# Altium schematic sheet 2312_Puissance.SchDoc
size A3; Author: Miguel Santos; Organization: ETML-ES; Address1: Avenue Recordon 1; Address2: 1004 Lausanne; Address3: Switzerland; SheetNumber: 2; SheetTotal: 7; Version: 1.0
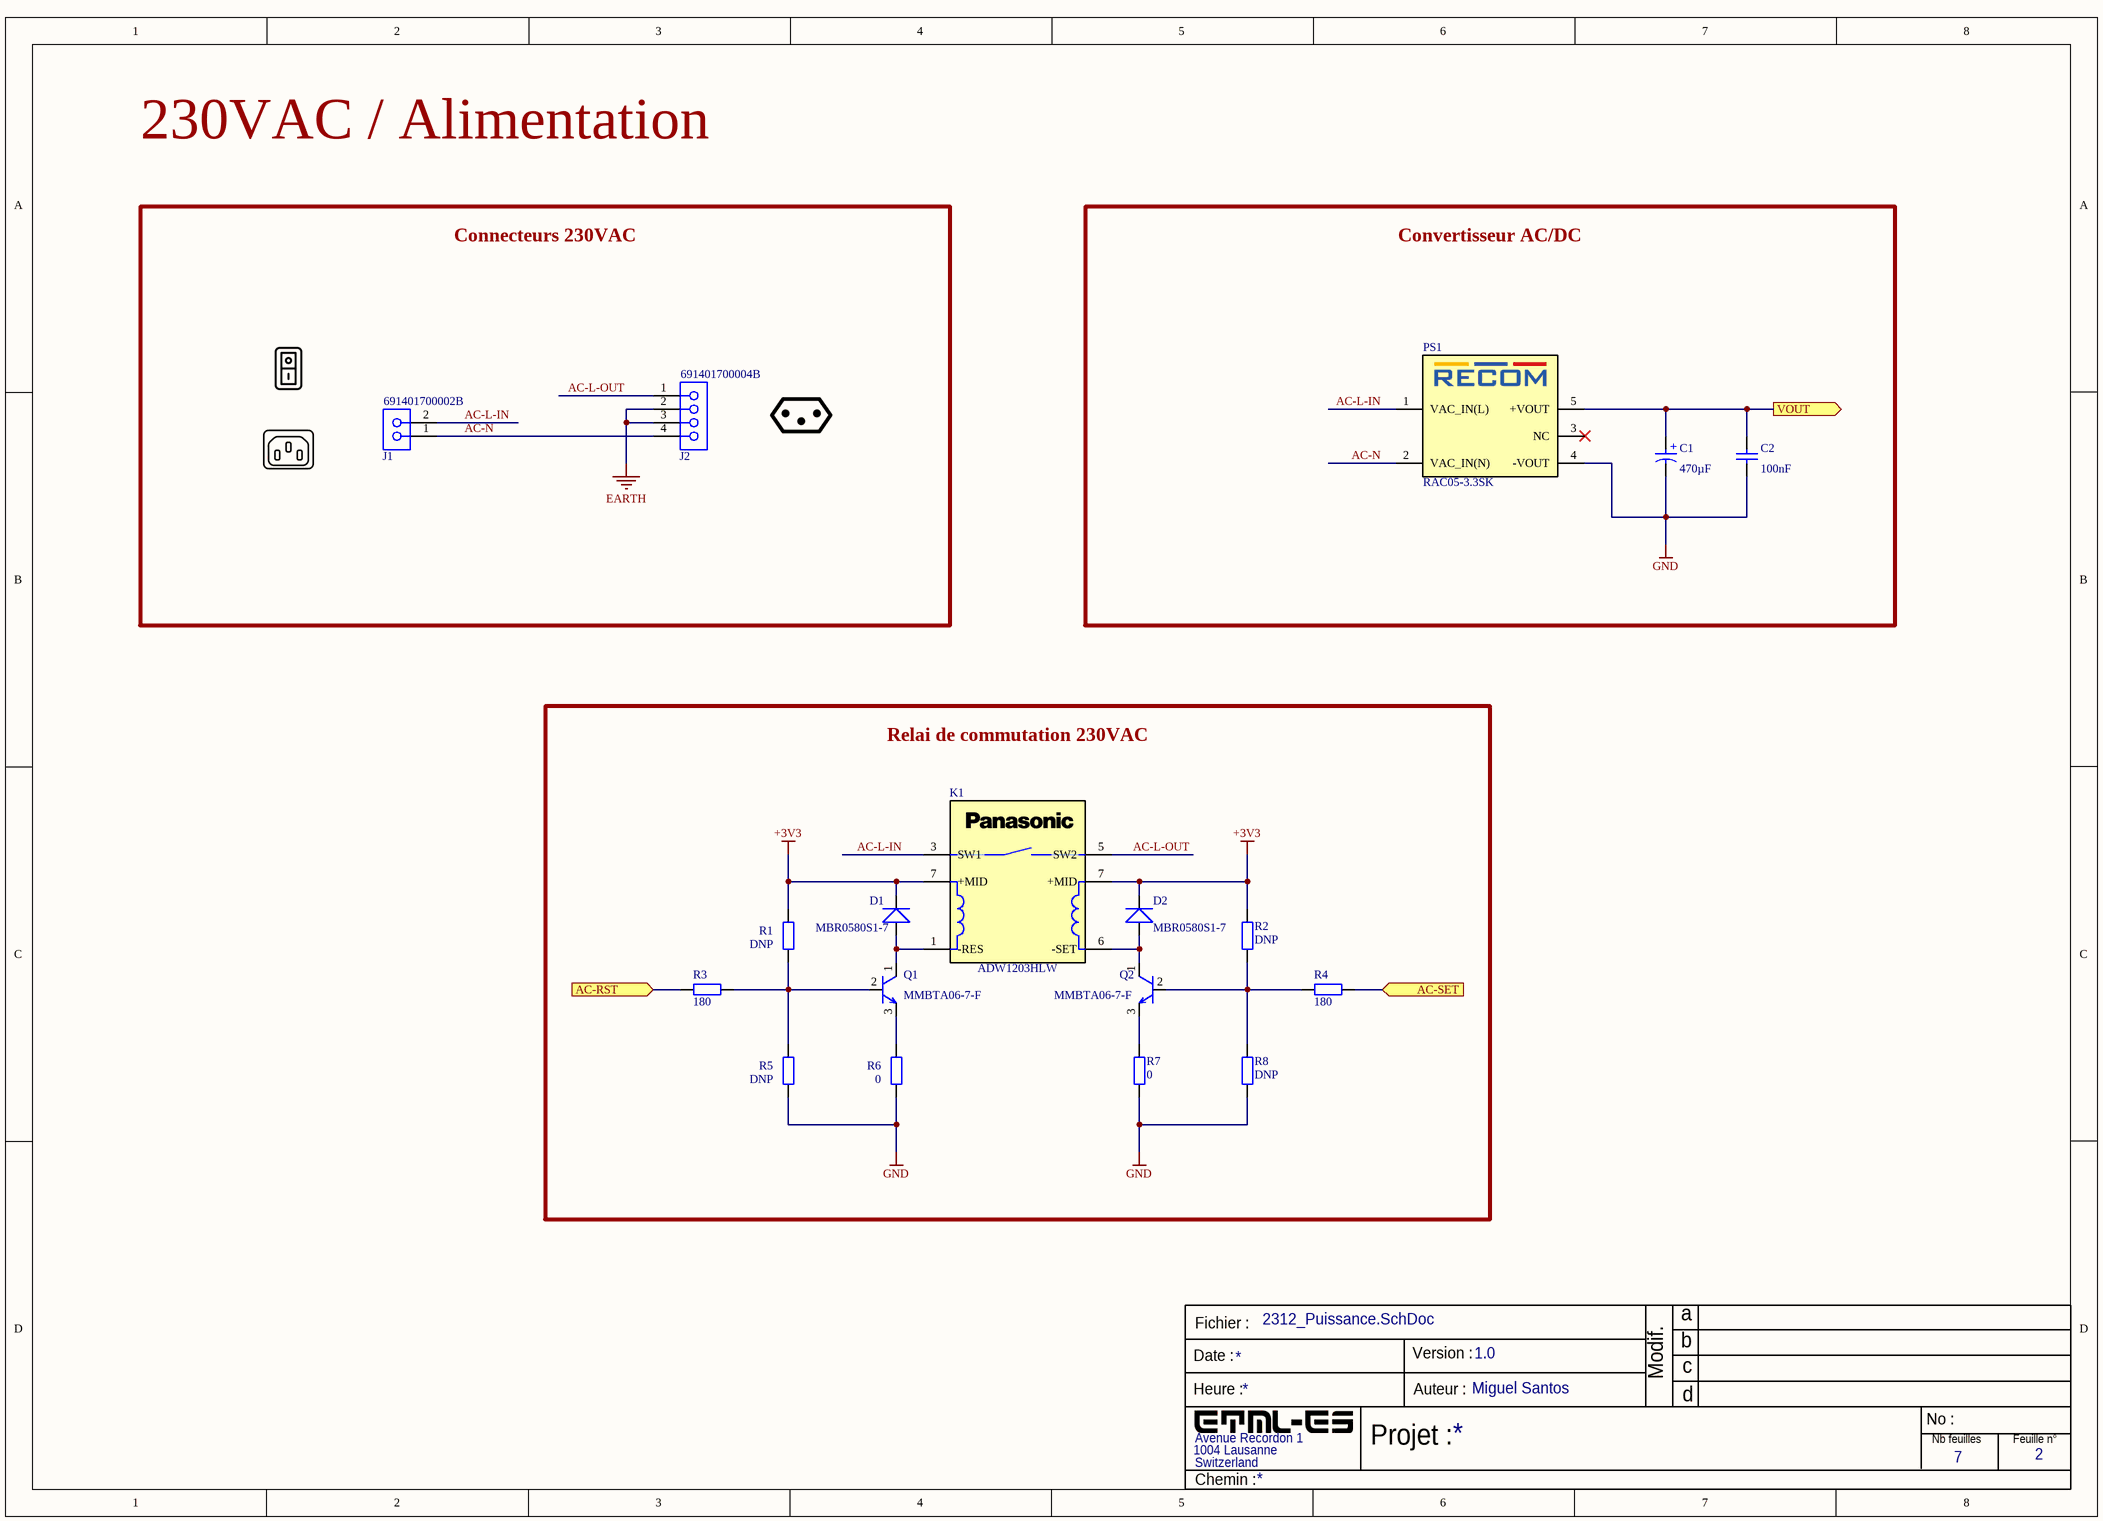
[diagram p0: 2312_Puissance.SchDoc]

## Parts
C1  Capacitance: 470µF  [WCAP-PSHP_D8H7.7]  (hidden comment: 875115150005)
C2  Capacitance: 100nF  [WCAP-CSGP_0805_L2W1.25H0.8_Reflow]  (hidden comment: 885012207016)
D1  MBR0580S1-7  [MBR0580S1-7_DIO-M]
D2  MBR0580S1-7  [MBR0580S1-7_DIO-M]
J1  691401700002B  [691401700002B]
J2  691401700004B  [691401700004B]
K1  ADW1203HLW  [ADW1203HLW]
PS1  RAC05-3.3SK  [CONV_RAC05-3.3SK]
Q1  MMBTA06-7-F  [SOT91P240X120-3N]
Q2  MMBTA06-7-F  [SOT91P240X120-3N]
R1  Resistance: DNP  [2312-RES-0805]  (hidden comment: RES-0805)
R2  Resistance: DNP  [2312-RES-0805]  (hidden comment: RES-0805)
R3  Resistance: 180  [2312-RES-0805]  (hidden comment: RES-0805)
R4  Resistance: 180  [2312-RES-0805]  (hidden comment: RES-0805)
R5  Resistance: DNP  [2312-RES-0805]  (hidden comment: RES-0805)
R6  Resistance: 0  [2312-RES-0805]  (hidden comment: RES-0805)
R7  Resistance: 0  [2312-RES-0805]  (hidden comment: RES-0805)
R8  Resistance: DNP  [2312-RES-0805]  (hidden comment: RES-0805)

## Blocks framed on the sheet
Connecteurs 230VAC: J1 J2
Convertisseur AC/DC: C1 C2 PS1
Relai de commutation 230VAC: D1 D2 K1 Q1 Q2 R1-R8

## Ports
AC-RST (in), AC-SET (in), VOUT (out)

## Nets
+3V3: D1.2 D2.2 K1.7(+MID) R1.2 R2.2
EARTH: J2.2 J2.3
GND: C1.2(N) C2.1 PS1.4(-VOUT) R5.1 R6.1 R7.1 R8.1
AC-L-IN: J1.2 K1.3(SW1) PS1.1(VAC_IN(L))
AC-L-OUT: J2.1 K1.5(SW2)
AC-N: J1.1 J2.4 PS1.2(VAC_IN(N))
AC-RST: R3.2 ; port AC-RST
AC-SET: R4.1 ; port AC-SET
VOUT: C1.1(P) C2.2 PS1.5(+VOUT) ; port VOUT
NetD1_1: D1.1 K1.1(-RES) Q1.1(COLLECTOR)
NetD2_1: D2.1 K1.6(-SET) Q2.1(COLLECTOR)
NetQ1_2: Q1.2(BASE) R1.1 R3.1 R5.2
NetQ1_3: Q1.3(EMITTER) R6.2
NetQ2_2: Q2.2(BASE) R2.1 R4.2 R8.2
NetQ2_3: Q2.3(EMITTER) R7.2

Not connected (* = marked no-connect by the designer): PS1 3(NC)*

## Notes on the sheet
- 230VAC / Alimentation
- Fichier :
- a
- Date :
- Heure :
- Version :
- Auteur :
- Modif.
- b
- c
- d
- Projet :
- No :
- Nb feuilles
- Feuille n°
- Chemin :
- (in symbol 875115150005) +

## Library data of the parts
C1 = 875115150005: WCAP-PSHP Aluminum Polymer Capacitor, V-Chip, SMT, D8 x H7.7mm, 470µF, 6.3V; Manufacturer: Wurth Elektronik; Capacitance Tolerance: +/-20%; Dissipation Factor: 8%; Endurance: 2000h; ESR: 20mΩ; Leakage Current: 592µA; Ripple Current: 3500mA; Technical Reference: PSEE077471M6R3DVCTDB000; Manufacturer Part Number: 875115150005; Category: Aluminum Polymer Capacitors; Match Code: WCAP-PSHP; ComponentLink1Description: Website Link; ComponentLink1URL: https://www.we-online.com/redexpert/article/875115150005?ad; ComponentLink2Description: Datasheet Link; ComponentLink2URL: https://www.we-online.com/redexpert/spec/875115150005?ad; Mount: Surface Mount; Operating Temperature Max: 105°C; Operating Temperature Min: -55°C; Packaging: Tape and Reel; Height: 7.7mm; Diameter: 8mm; Rated Voltage (DC): 6.3V
C2 = 885012207016: WCAP-CSGP Multilayer Ceramic Chip Capacitor, General Purpose, size 0805, X7R, 100nF, 10VDC; Manufacturer: Wurth Elektronik; Case/Size Code: 0805; Capacitance Tolerance: +/-10%; Dissipation Factor: 5%; Insulation Resistance: 5GΩ; Rated Voltage (DC): 10V; Technical Reference: X7R0805104K010DFCT10000; Manufacturer Part Number: 885012207016; Category: Multilayer Ceramic Chip Capacitors; Match Code: WCAP-CSGP; ComponentLink1Description: Website Link; ComponentLink1URL: https://www.we-online.com/redexpert/article/885012207016?ad; ComponentLink2Description: Datasheet Link; ComponentLink2URL: https://www.we-online.com/redexpert/spec/885012207016?ad; Mount: Surface Mount; Operating Temperature Max: 125°C; Operating Temperature Min: -55°C; Packaging: Tape and Reel; Length: 2mm; Width: 1.25mm; Height: 0.8mm; Ceramic Type: X7R
D1 D2 = MBR0580S1-7: Diode Shottky, 500mA, 80V; Mfr_Name: Diodes Inc; Digi-Key_Part_Number_3: MBR0580S1-7DIDKR-ND; Digi-Key_Part_Number_2: MBR0580S1-7DICT-ND; Digi-Key_Part_Number_1: MBR0580S1-7DITR-ND; RefDes: RefDes; Type: Type
J1 = 691401700002B: WR-TBL Series 401B Vertical Entry, THT, pitch 5mm, 2p; Manufacturer: Wurth Elektronik; Modularity: No; Rated Current: 10A; Working Voltage: 300V; ComponentLink1Description: Website Link; ComponentLink1URL: https://www.we-online.com/redexpert/article/691401700002B?ad; ComponentLink2Description: Datasheet Link; ComponentLink2URL: https://www.we-online.com/redexpert/spec/691401700002B?ad; Manufacturer Part Number: 691401700002B; Category: Terminal Blocks; Match Code: WR-TBL; Mount: Through Hole; Operating Temperature Max: 105°C; Operating Temperature Min: -40°C; Packaging: Box; Application: Screwless; Number of Pins: 2; Number of Rows: 1; Orientation: Vertical; Pitch: 5mm
J2 = 691401700004B: WR-TBL Series 401B Vertical Entry, THT, pitch 5mm, 4p; Manufacturer: Wurth Elektronik; Modularity: No; Rated Current: 10A; Working Voltage: 300V; ComponentLink1Description: Website Link; ComponentLink1URL: https://www.we-online.com/redexpert/article/691401700004B?ad; ComponentLink2Description: Datasheet Link; ComponentLink2URL: https://www.we-online.com/redexpert/spec/691401700004B?ad; Manufacturer Part Number: 691401700004B; Category: Terminal Blocks; Match Code: WR-TBL; Mount: Through Hole; Operating Temperature Max: 105°C; Operating Temperature Min: -40°C; Packaging: Box; Application: Screwless; Number of Pins: 4; Number of Rows: 1; Orientation: Vertical; Pitch: 5mm
K1 = ADW1203HLW: RELAY GEN PURPOSE SPST 16A 3V; Manufacturer: Panasonic Electric Works; Rated Current: 16A; Manufacturer Part Number: ADW1203HLW; Working Voltage: 3V
PS1 = RAC05-3.3SK: 5W AC/DC-Converter 'POWERLINE' 1x1 4kV reg; MF: Recom Power; Value: *; Package: DIP-5 Recom Power; MP: RAC05-3.3SK; Price: None; SnapEDA_Link: https://www.snapeda.com/parts/RAC05-3.3SK/Recom%20Power/view-part/2834355/?ref=snap; Availability: Unavailable
Q1 Q2 = MMBTA06LT3G: Bipolar (BJT) Transistor NPN 80V 500mA 100MHz 225mW Surface Mount SOT-23-3 (TO-236)
R1 R8 = RES-0805: SMD Resistor 0805, 1.4kΩ
R2 R5 = RES-0805: SMD Resistor 0805, DNP
R3 R4 = RES-0805: SMD Resistor 0805, 140Ω
R6 R7 = RES-0805: SMD Resistor 0805, 2Ω